# Altium project PCB_BA100_MAIN.PrjPcb
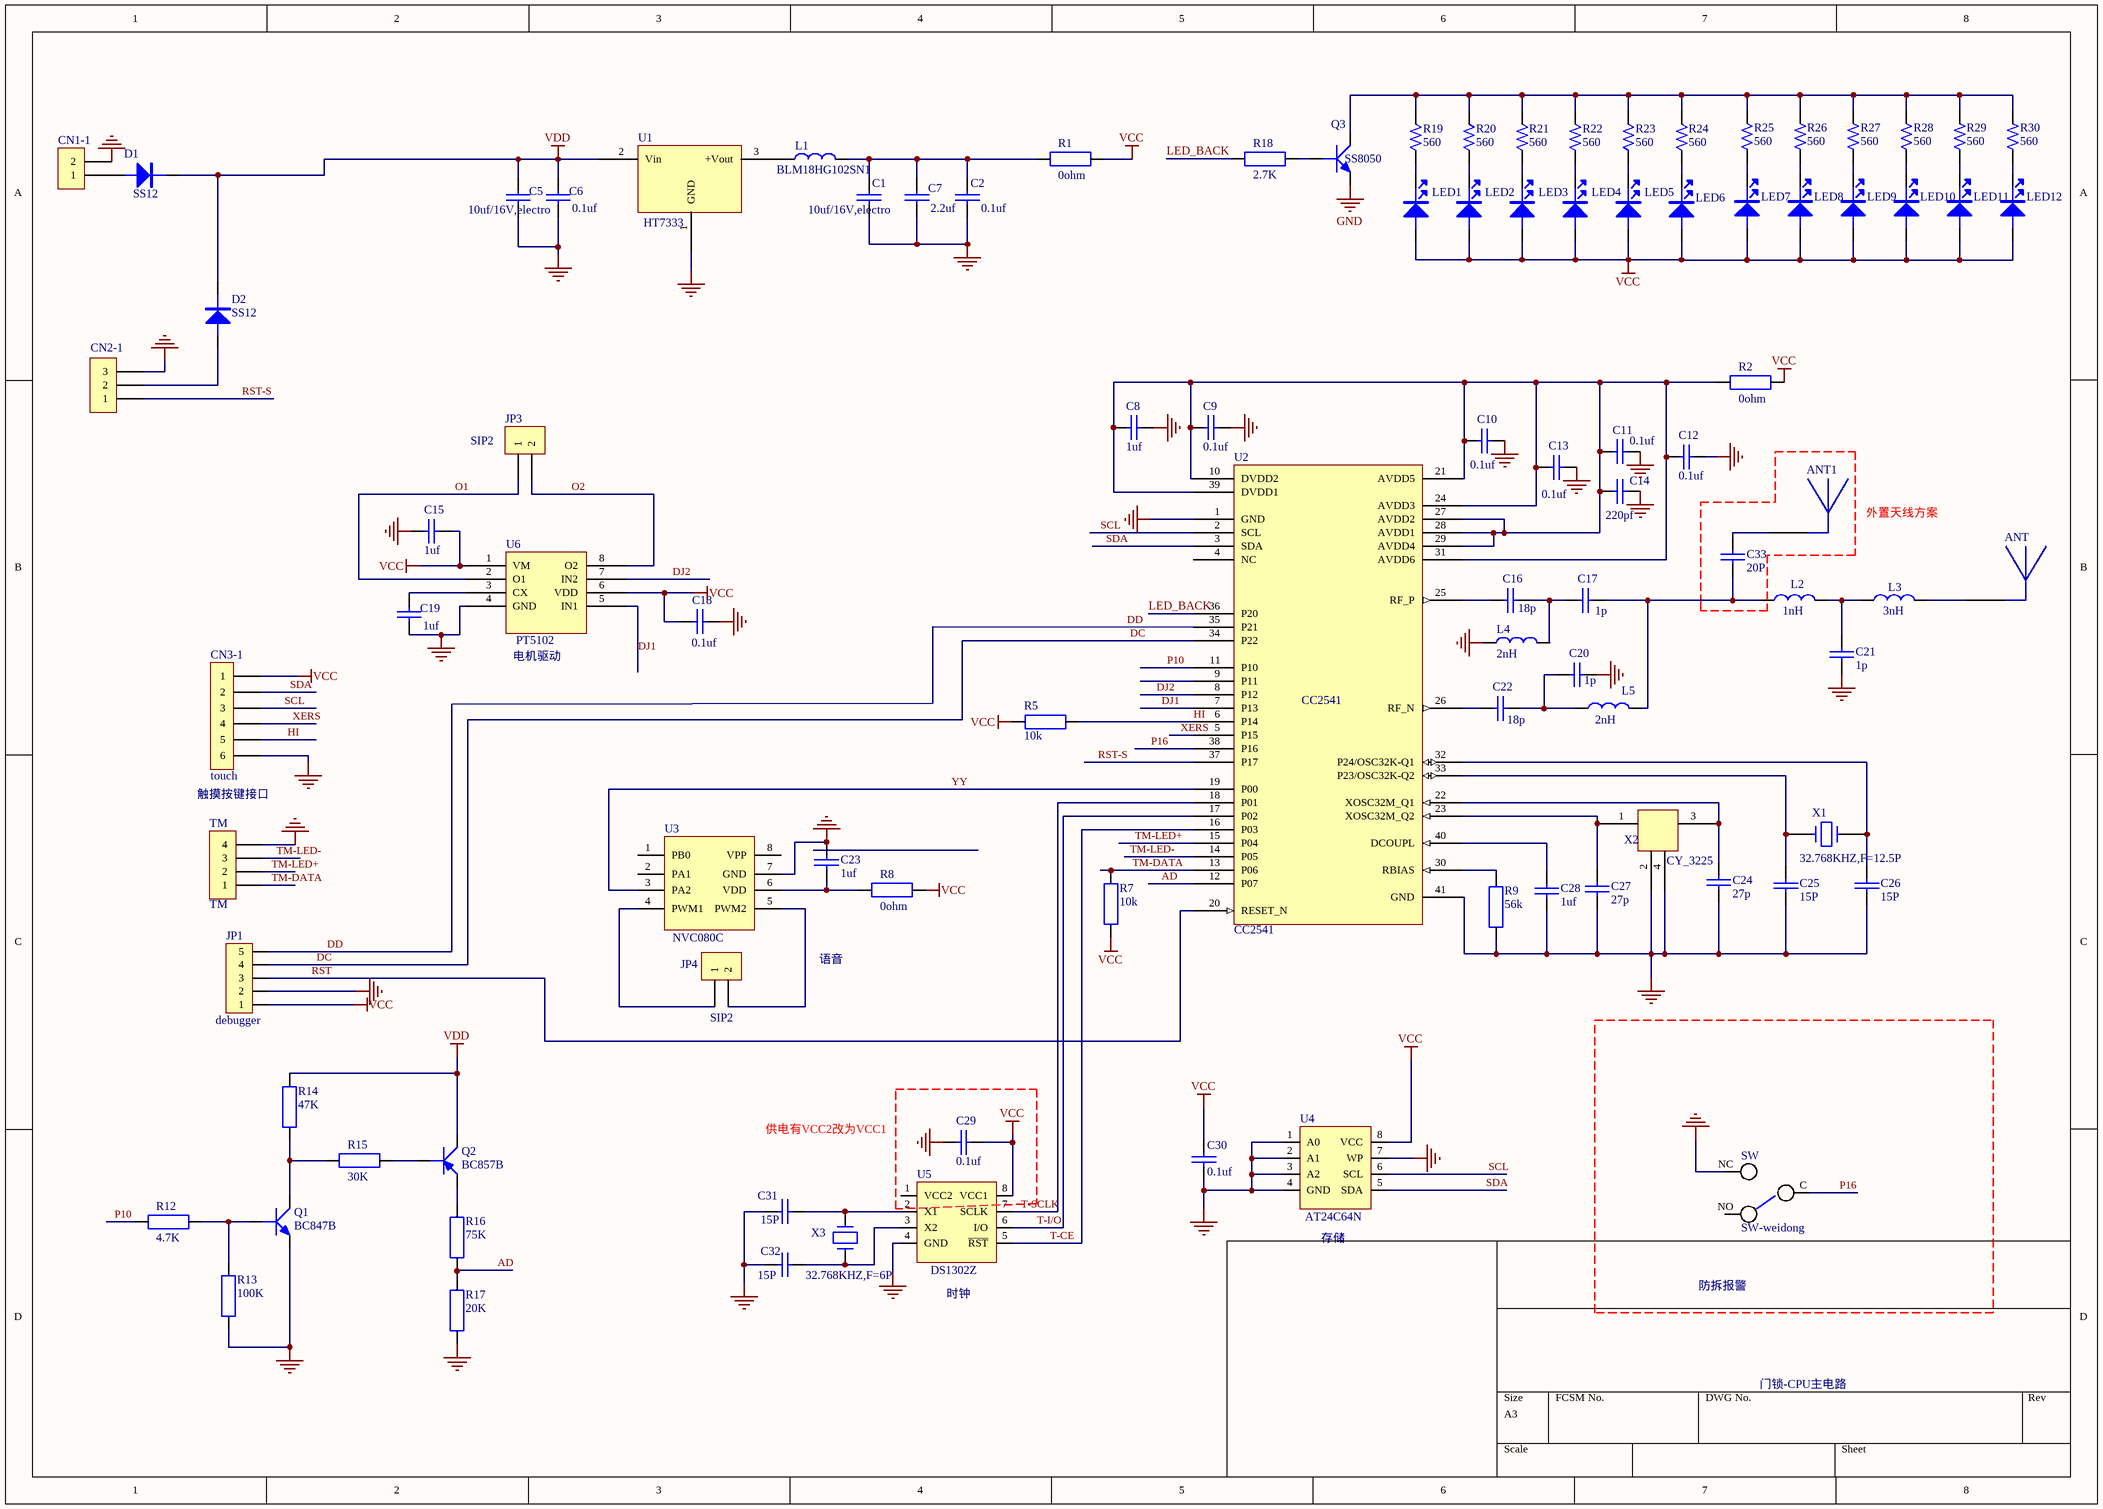
[diagram p0: BA100_CPU_V1.0.SchDoc]
1 sheet, 97 parts. Net scope: global (net labels, ports and power ports of the same name join across sheets).
Board file: BA100_CPU_V1.0.PcbDoc

## Sheet BA100_CPU_V1.0.SchDoc
size A3

### Parts
ANT  ANT  [ANT]  (value not drawn)
ANT1  ANT  [IPEX]  (value not drawn)
C1  10uf/16V,electro  [ECAP_10U_4.3*4.3]
C2  0.1uf  [PC7-*****-KO-0A_0603_TDK]
C5  10uf/16V,electro  [ECAP_10U_4.3*4.3]
C6  0.1uf  [PC5-*****-**-0A_0603_TDK]
C7  2.2uf  [PC5-*****-**-0A_0603_TDK]
C8  1uf  [PC5-*****-**-0A_0603_TDK]
C9  0.1uf  [PC7-*****-KO-0A_0603_TDK]
C10  0.1uf  [PC5-*****-**-0A_0603_TDK]
C11  0.1uf  [PC7-*****-KQA0A_0402_YAGEO]
C12  0.1uf  [PC7-*****-KQA0A_0402_YAGEO]
C13  0.1uf  [PC7-*****-KQA0A_0402_YAGEO]
C14  220pf  [PC7-*****-KQA0A_0402_YAGEO]
C15  1uf  [PC5-*****-**-0A_0603_TDK]
C16  18p  [PC7-*****-KQA0A_0402_YAGEO]
C17  1p  [PC7-*****-KQA0A_0402_YAGEO]
C18  0.1uf  [PC5-*****-**-0A_0603_TDK]
C19  1uf  [PC5-*****-**-0A_0603_TDK]
C20  1p  [PC7-*****-KQA0A_0402_YAGEO]
C21  1p  [PC7-*****-KQA0A_0402_YAGEO]
C22  18p  [PC7-*****-KQA0A_0402_YAGEO]
C23  1uf  [PC5-*****-**-0A_0603_TDK]
C24  27p  [PC7-*****-KO-0A_0603_TDK]
C25  15P  [PC5-*****-**-0A_0603_TDK]
C26  15P  [PC7-*****-KO-0A_0603_TDK]
C27  27p  [PC7-*****-KO-0A_0603_TDK]
C28  1uf  [PC5-*****-**-0A_0603_TDK]
C29  0.1uf  [PC7-*****-KO-0A_0603_TDK]
C30  0.1uf  [PC5-*****-**-0A_0603_TDK]
C31  15P  [PC7-*****-KO-0A_0603_TDK]
C32  15P  [PC7-*****-KO-0A_0603_TDK]
C33  20P  [PC7-*****-KQA0A_0402_YAGEO]
CN1-1  CN1  [PH2.0-2PIN-SMT]  (value not drawn)
CN2-1  CN2  [PH2.0-3PIN-SMT]  (value not drawn)
CN3-1  touch  [PH1.25-6PIN-SMT]
D1  SS12  [SS12-DIDEO]
D2  SS12  [SS12-DIDEO]
JP1  debugger  [ISCP-5PIN]
JP3  SIP2  [PH2.0-2PIN-LSMT1]
JP4  SIP2  [PH2.0-2PIN-LSMT1]
L1  BLM18HG102SN1  [PC7-*****-KO-0A_0603_TDK]
L2  1nH  [PC5-*****-**-0A_0402_TDK]
L3  3nH  [PC5-*****-**-0A_0402_TDK]
L4  2nH  [PC5-*****-**-0A_0402_TDK]
L5  2nH  [PC5-*****-**-0A_0402_TDK]
LED1  MA2X335  [LED-0805]  (value not drawn)
LED2  MA2X335  [LED-0805]  (value not drawn)
LED3  MA2X335  [LED-0805]  (value not drawn)
LED4  MA2X335  [LED-0805]  (value not drawn)
LED5  MA2X335  [LED-0805]  (value not drawn)
LED6  MA2X335  [LED-0805]  (value not drawn)
LED7  MA2X335  [LED-0805]  (value not drawn)
LED8  MA2X335  [LED-0805]  (value not drawn)
LED9  MA2X335  [LED-0805]  (value not drawn)
LED10  MA2X335  [LED-0805]  (value not drawn)
LED11  MA2X335  [LED-0805]  (value not drawn)
LED12  MA2X335  [LED-0805]  (value not drawn)
Q1  BC847B  [PTR-C0025-00-2A_2SC1623]
Q2  BC857B  [PTR-C0025-00-2A_2SC1623]
Q3  SS8050  [PTR-C0025-00-2A_2SC1623]
R1  0ohm  [PRC-*****-AM-0A_0603]
R2  0ohm  [PRC-*****-AM-0A_0603]
R5  10k  [PRC-*****-AM-0A_0603]
R7  10k  [PRC-*****-AM-0A_0603]
R8  0ohm  [PRC-*****-AM-0A_0603]
R9  56k  [PRC-*****-BM-0A_0402]
R12  4.7K  [PRC-*****-AM-0A_0603]
R13  100K  [PRC-*****-AM-0A_0603]
R14  47K  [PRC-*****-AM-0A_0603]
R15  30K  [PRC-*****-AM-0A_0603]
R16  75K  [PRC-*****-AM-0A_0603]
R17  20K  [PRC-*****-AM-0A_0603]
R18  2.7K  [PRC-*****-AM-0A_0603]
R19  560  [PRC-*****-AM-0A_0603]
R20  560  [PRC-*****-AM-0A_0603]
R21  560  [PRC-*****-AM-0A_0603]
R22  560  [PRC-*****-AM-0A_0603]
R23  560  [PRC-*****-AM-0A_0603]
R24  560  [PRC-*****-AM-0A_0603]
R25  560  [PRC-*****-AM-0A_0603]
R26  560  [PRC-*****-AM-0A_0603]
R27  560  [PRC-*****-AM-0A_0603]
R28  560  [PRC-*****-AM-0A_0603]
R29  560  [PRC-*****-AM-0A_0603]
R30  560  [PRC-*****-AM-0A_0603]
SW  SW-weidong  [SW-weidong]
TM  TM  [PH2.0-4PIN-SMT]
U1  HT7333  [SOT89]
U2  CC2541  [CC2530_QFN40]
U3  NVC080C  [SOP-8]
U4  AT24C64N  [PIC-00570-40-2A_93LC46B]
U5  DS1302Z  [PIC-00570-40-2A_93LC46B]
U6  PT5102  [PT5102]
X1  32.768KHZ,F=12.5P  [FC-135]
X2  CY_3225  [CY_3225]
X3  32.768KHZ,F=6P  [FC-135]

### Blocks framed on the sheet
防拆报警: SW

### Nets
GND: C1.1 C2.1 C5.1 C6.1 C7.2 C8.2 C9.2 C10.2 C11.2 C12.2 C13.2 C14.1 C15.1 C18.1 C19.1 C20.2 C21.1 C23.2 C24.1 C25.1 C26.1 C27.1 C28.1 C29.2 C30.1 C31.2 C32.2 CN1-1.2 CN2-1.3 CN3-1.6 JP1.2 L4.1 Q1.E Q3.E R9.2 R13.1 R17.1 SW.NC TM.4 U1.1(GND) U2.1(GND) U2.41(GND) U3.7(GND) U4.1(A0) U4.2(A1) U4.3(A2) U4.4(GND) U4.7(WP) U5.4(GND) U6.4(GND) X2.2 X2.4
VCC: C15.2 C18.2 C29.1 C30.2 CN3-1.1 JP1.1 LED1.A LED2.A LED3.A LED4.A LED5.A LED6.A LED7.A LED8.A LED9.A LED10.A LED11.A LED12.A R1.2 R2.2 R5.1 R7.1 R8.2 U4.8(VCC) U5.8(VCC1) U6.1(VM) U6.6(VDD)
VDD: C5.2 C6.2 D1.1 D2.1 Q2.C R14.2 U1.2(Vin)
AD: R16.1 R17.2 U2.12(P07)
DC: JP1.4 U2.34(P22)
DD: JP1.5 U2.35(P21)
DJ1: U2.7(P13) U6.5(IN1)
DJ2: U2.8(P12) U6.7(IN2)
HI: CN3-1.5 R5.2 U2.6(P14)
LED_BACK: R18.1 U2.36(P20)
O1: JP3.1 U6.2(O1)
O2: JP3.2 U6.8(O2)
P10: R12.1 U2.11(P10)
P16: SW.C U2.38(P16)
RST: JP1.3 U2.20(RESET_N)
RST-S: CN2-1.1 U2.37(P17)
SCL: CN3-1.3 U2.2(SCL) U4.6(SCL)
SDA: CN3-1.2 U2.3(SDA) U4.5(SDA)
T-CE: U2.16(P03) U5.5(~{RST})
T-I/O: U2.17(P02) U5.6(I/O)
T-SCLK: U2.18(P01) U5.7(SCLK)
TM-DATA: R7.2 TM.1 U2.13(P06)
TM-LED+: TM.2 U2.15(P04)
TM-LED-: TM.3 U2.14(P05)
XERS: CN3-1.4 U2.5(P15)
YY: U2.19(P00) U3.3(PA2)
NetANT1_1: ANT1.1 C33.2
NetANT_1: ANT.1 L3.2
NetC1_2: C1.2 C2.2 C7.1 L1.2 R1.1
NetC8_1: C8.1 C9.1 C10.1 C11.1 C12.1 C13.1 C14.2 R2.1 U2.10(DVDD2) U2.21(AVDD5) U2.24(AVDD3) U2.27(AVDD2) U2.28(AVDD1) U2.29(AVDD4) U2.31(AVDD6) U2.39(DVDD1)
NetC16_1: C16.1 U2.25(RF_P)
NetC16_2: C16.2 C17.1 L4.2
NetC17_2: C17.2 C33.1 L2.1 L5.2
NetC19_2: C19.2 U6.3(CX)
NetC20_1: C20.1 C22.2 L5.1
NetC21_2: C21.2 L2.2 L3.1
NetC22_1: C22.1 U2.26(RF_N)
NetC23_1: C23.1 R8.1 U3.6(VDD)
NetC24_2: C24.2 U2.22(XOSC32M_Q1) X2.3
NetC25_2: C25.2 U2.33(P23/OSC32K-Q2) X1.1
NetC26_2: C26.2 U2.32(P24/OSC32K-Q1) X1.2
NetC27_2: C27.2 U2.23(XOSC32M_Q2) X2.1
NetC28_2: C28.2 U2.40(DCOUPL)
NetC31_1: C31.1 U5.2(X1) X3.2
NetC32_1: C32.1 U5.3(X2) X3.1
NetCN1-1_1: CN1-1.1 D1.2
NetCN2-1_2: CN2-1.2 D2.2
NetJP4_1: JP4.1 U3.4(PWM1)
NetJP4_2: JP4.2 U3.5(PWM2)
NetL1_1: L1.1 U1.3(+Vout)
NetLED1_C: LED1.C R19.1
NetLED2_C: LED2.C R20.1
NetLED3_C: LED3.C R21.1
NetLED4_C: LED4.C R22.1
NetLED5_C: LED5.C R23.1
NetLED6_C: LED6.C R24.1
NetLED7_C: LED7.C R25.1
NetLED8_C: LED8.C R26.1
NetLED9_C: LED9.C R27.1
NetLED10_C: LED10.C R28.1
NetLED11_C: LED11.C R29.1
NetLED12_C: LED12.C R30.1
NetQ1_B: Q1.B R12.2 R13.2
NetQ1_C: Q1.C R14.1 R15.1
NetQ2_B: Q2.B R15.2
NetQ2_E: Q2.E R16.2
NetQ3_B: Q3.B R18.2
NetQ3_C: Q3.C R19.2 R20.2 R21.2 R22.2 R23.2 R24.2 R25.2 R26.2 R27.2 R28.2 R29.2 R30.2
NetR9_1: R9.1 U2.30(RBIAS)

Not connected (* = marked no-connect by the designer): SW NO(2); U2 4(NC) 9(P11); U3 1(PB0) 2(PA1) 8(VPP); U5 1(VCC2)

### Notes on the sheet
- 外置天线方案
- (near U6) 电机驱动
- 触摸按键接口
- 语音
- 供电有VCC2改为VCC1
- (near U4) 存储
- (near U5) 时钟
- 门锁-CPU主电路

### Library data of the parts
C1 C2 C5-C33 = PC7_0402_YAGEO: PC7-*****-KQA0A
CN1-1 JP3 JP4 = CON2: Connector
CN2-1 = JP1_E524.03: Revision: 17-Jul-2002: Re-released for DXP Platform.; Publisher: Altium Limited
CN3-1 = CON6
D1 D2 = PDD_SD101CWS: PDD-00330-00-2A
JP1 = CON5
L1-L5 = PWL_18nH: PWL-00195-00-20
LED1-LED12 = PDD_MA2X335: LED
Q1 = PTR_2SC3356: PTR-C0028-00-2A
Q2 = PTR-PNP
Q3 = PTR_2SC5344SF-Y: PTR-C0230-00-20**
R1 R2 R5 R7-R9 R12-R18 = PRC_0603: PRC-*****-AM-0A_0603; Text Field1: pristel=\Models.lib
R19-R30 = RES: PSpiceTemplate: *; TOLERANCE: *; Right: *; Bottom: *
TM = HDR1X4 ***
U1 = LM117K
U3 = NV040C
U5 = DS1302
U6 = Component_1_1
X1 = CRYSTAL
X3 = PTR_16MHZ: PTR-X0320-20-2A